# EAGLE design HUM-ASM-001 (EAGLE 9.5.1)

## Sheet 1 of 3: MCU
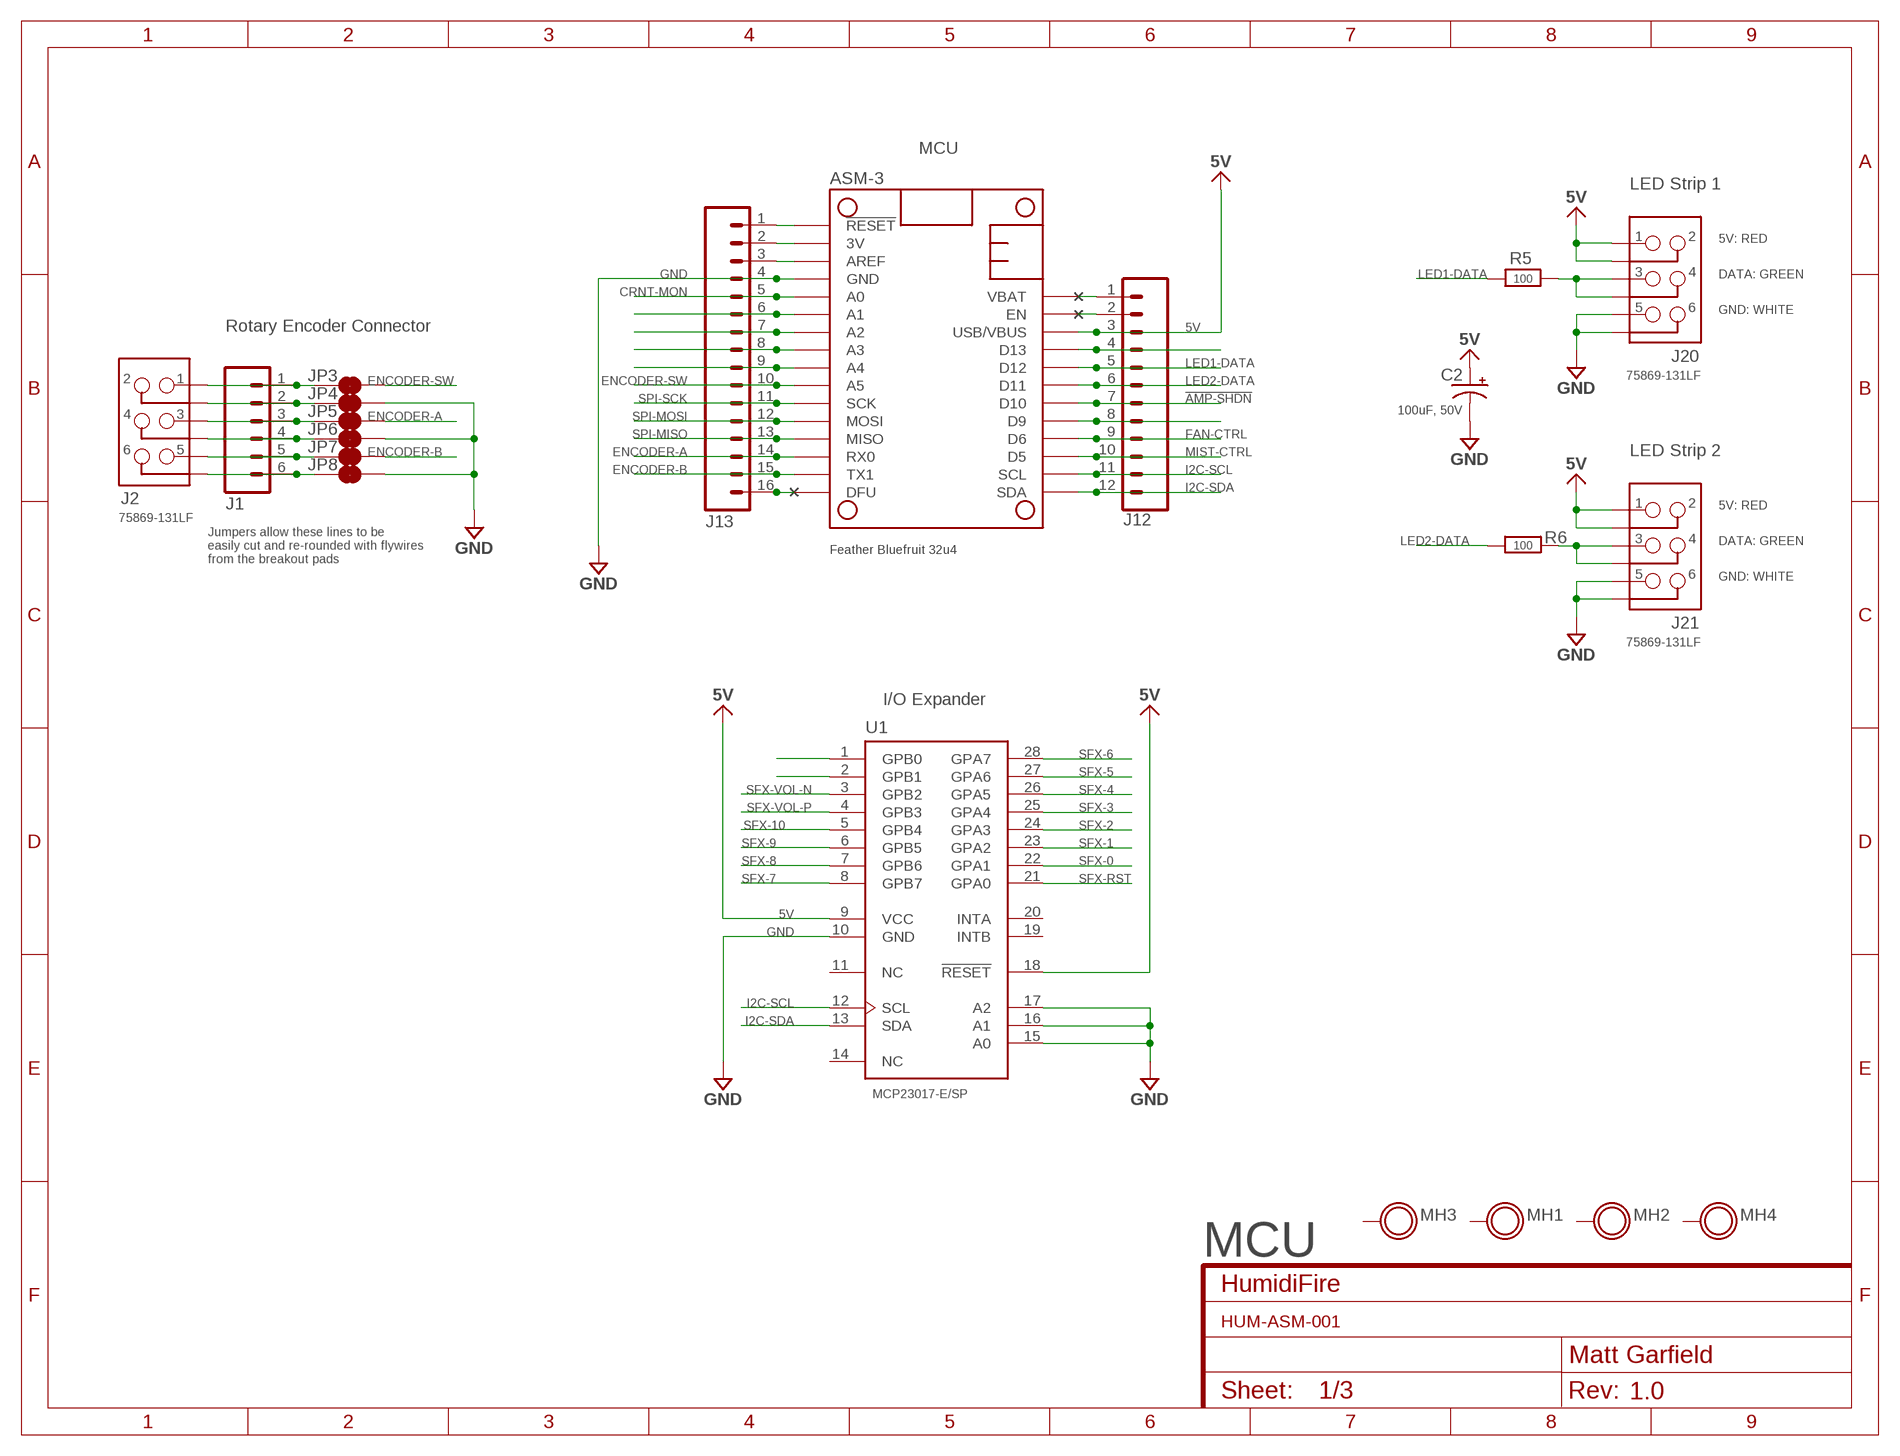
[diagram p0: schematic, sheet 1]
FRAME1 (SCH_FRAME_LETTER_8.5X11): CNAME: HumidiFire; CREVISION: 1.0; DESIGNER: Matt Garfield

### Parts
ASM-3  Feather Bluefruit 32u4  ASM_ADAFRUIT_FEATHER_BLUEFRUIT  [ASM_ADAFRUIT_FEATHER_BLUEFRUIT]
C2  100uF, 50V  CAP_THT_POL-E-035X080MM  [CAP_E-035X080]
J1  CON_HEADER_1X6NO_SILK_FEMALE_PTH  [1X06_NO_SILK]
J2  75869-131LF  CON_HEADER_2X3-SHROUD  [2X3-SHROUDED]
J12  CON_HEADER_1X12_NO_SILK  [1X12_NO_SILK]
J13  CON_HEADER_1X16-1X16_NO_SILK  [1X16_NO_SILK]
J20  75869-131LF  CON_HEADER_2X3-SHROUD  [2X3-SHROUDED]
J21  75869-131LF  CON_HEADER_2X3-SHROUD  [2X3-SHROUDED]
JP3  CON_JUMPER_PAD-2-NC_BY_TRACE  [PAD-JUMPER-2-NC_BY_TRACE_YES_SILK]
JP4  CON_JUMPER_PAD-2-NC_BY_TRACE  [PAD-JUMPER-2-NC_BY_TRACE_YES_SILK]
JP5  CON_JUMPER_PAD-2-NC_BY_TRACE  [PAD-JUMPER-2-NC_BY_TRACE_YES_SILK]
JP6  CON_JUMPER_PAD-2-NC_BY_TRACE  [PAD-JUMPER-2-NC_BY_TRACE_YES_SILK]
JP7  CON_JUMPER_PAD-2-NC_BY_TRACE  [PAD-JUMPER-2-NC_BY_TRACE_YES_SILK]
JP8  CON_JUMPER_PAD-2-NC_BY_TRACE  [PAD-JUMPER-2-NC_BY_TRACE_YES_SILK]
MH1  PCB_MOUNTING-HOLE_IN_PLATED  [TOOLING_HOLE_0.125_IN_HORSESHOE]
MH2  PCB_MOUNTING-HOLE_IN_PLATED  [TOOLING_HOLE_0.125_IN_HORSESHOE]
MH3  PCB_MOUNTING-HOLE_IN_PLATED  [TOOLING_HOLE_0.125_IN_HORSESHOE]
MH4  PCB_MOUNTING-HOLE_IN_PLATED  [TOOLING_HOLE_0.125_IN_HORSESHOE]
R5  100  RES_RESISTOR-PTH-1/4W  [AXIAL-0.4]
R6  100  RES_RESISTOR-PTH-1/4W  [AXIAL-0.4]
U1  MCP23017-E/SP  IIC_MCP23017-E/SP  [DIP787W45P254L3556H508Q28]

### Nets
3V: ASM-3.3V3(3V) J13.2
5V: ASM-3.USB/VBUS C2.+ J12.3 J20.1 J20.2 J21.1 J21.2 U1.9(VCC) U1.18(!RESET) ; supply symbol labelled V5.0 ; also sheet 2,3
!AMP-SHDN: ASM-3.D10 J12.7 ; also sheet 3
CRNT-MON: ASM-3.A0 J13.5 ; also sheet 2
DFU: ASM-3.DFU J13.16
ENCODER-A: ASM-3.RX0 J13.14 JP5.1
ENCODER-B: ASM-3.TX1 J13.15 JP7.1
ENCODER-SW: ASM-3.A5 J13.10 JP3.1
FAN-CTRL: ASM-3.D6 J12.9 ; also sheet 2
GND: ASM-3.GND@4(GND) C2.- J13.4 J20.5 J20.6 J21.5 J21.6 JP4.1 JP6.1 JP8.1 U1.10(GND) U1.15(A0) U1.16(A1) U1.17(A2) ; supply symbol labelled V0_GND ; also sheet 2,3
I2C-SCL: ASM-3.SCL J12.11 U1.12(SCL)
I2C-SDA: ASM-3.SDA J12.12 U1.13(SDA)
LED1-DATA: ASM-3.D12 J12.5 R5.P$2(P2)
LED2-DATA: ASM-3.D11 J12.6 R6.P$1(P1)
MIST-CTRL: ASM-3.D5 J12.10 ; also sheet 2
N$1: ASM-3.!RESET J13.1
N$2: ASM-3.AREF J13.3
N$3: U1.1(GPB0)
N$4: U1.2(GPB1)
N$5: ASM-3.A1 J13.6
N$6: ASM-3.A2 J13.7
N$7: ASM-3.A3 J13.8
N$8: ASM-3.A4 J13.9
N$9: J20.3 J20.4 R5.P$1(P1)
N$18: J1.1 J2.1 JP3.2
N$20: ASM-3.D9 J12.8
N$21: J1.2 J2.2 JP4.2
N$22: J1.3 J2.3 JP5.2
N$24: ASM-3.D13 J12.4
N$25: ASM-3.EN J12.2
N$39: J1.4 J2.4 JP6.2
N$40: J1.5 J2.5 JP7.2
N$41: J1.6 J2.6 JP8.2
N$42: J21.3 J21.4 R6.P$2(P2)
SFX-0: U1.22(GPA1) ; also sheet 3
SFX-1: U1.23(GPA2) ; also sheet 3
SFX-2: U1.24(GPA3) ; also sheet 3
SFX-3: U1.25(GPA4) ; also sheet 3
SFX-4: U1.26(GPA5) ; also sheet 3
SFX-5: U1.27(GPA6) ; also sheet 3
SFX-6: U1.28(GPA7) ; also sheet 3
SFX-7: U1.8(GPB7) ; also sheet 3
SFX-8: U1.7(GPB6) ; also sheet 3
SFX-9: U1.6(GPB5) ; also sheet 3
SFX-10: U1.5(GPB4) ; also sheet 3
SFX-RST: U1.21(GPA0) ; also sheet 3
SFX-VOL-N: U1.3(GPB2) ; also sheet 3
SFX-VOL-P: U1.4(GPB3) ; also sheet 3
SPI-MISO: ASM-3.MISO J13.13
SPI-MOSI: ASM-3.MOSI J13.12
SPI-SCK: ASM-3.SCK J13.11
VBAT: ASM-3.VBAT J12.1
Unconnected: MH1.P$1(P1) MH2.P$1(P1) MH3.P$1(P1) MH4.P$1(P1) U1.11(NC) U1.14(NC) U1.19(INTB) U1.20(INTA)

### Notes on the sheet
- MCU
- LED Strip 1
- 5V: RED
- DATA: GREEN
- GND: WHITE
- Rotary Encoder Connector
- LED Strip 2
- 5V: RED
- DATA: GREEN
- Jumpers allow these lines to be
  easily cut and re-rounded with flywires 
  from the breakout pads
- GND: WHITE
- I/O Expander
- MCU

## Sheet 2 of 3: Power
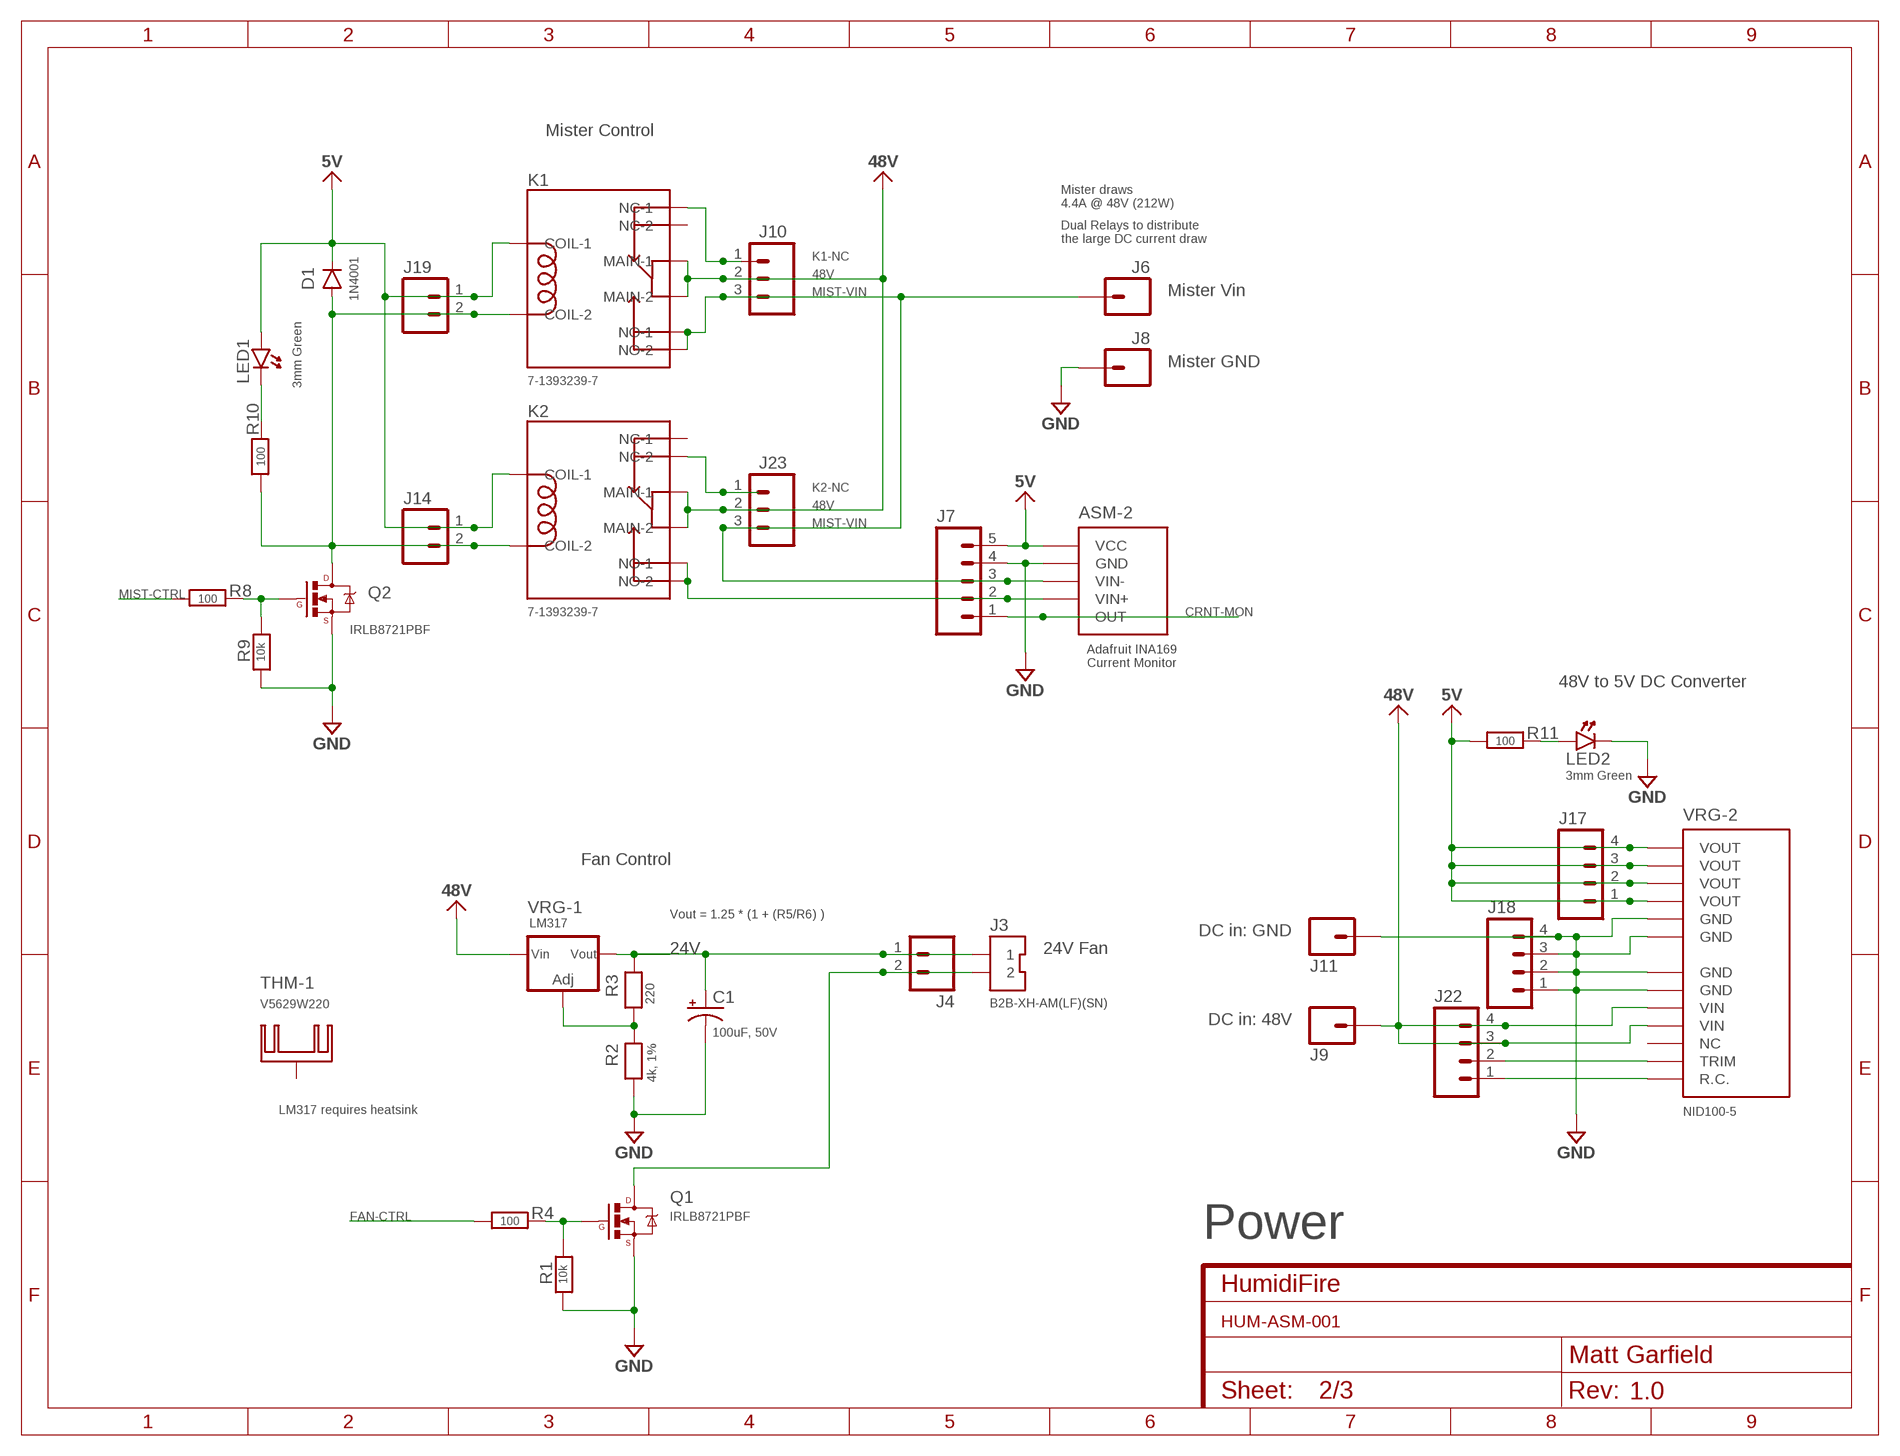
[diagram p1: schematic, sheet 2]
FRAME4 (SCH_FRAME_LETTER_8.5X11): CNAME: HumidiFire; CREVISION: 1.0; DESIGNER: Matt Garfield

### Parts
ASM-2  ASM_ADAFRUIT_INA169  [ASM_ADAFRUIT_INA169_MOUNTING_HOLES]
C1  100uF, 50V  CAP_THT_POL-E-035X080MM  [CAP_E-035X080]
D1  1N4001  DIO_DIODEPTH  [DIODE-1N4001]
J3  B2B-XH-AM(LF)(SN)  CON_JST_2-PIN_B2B-XH-AM  [JST-2-PTH-VERT_XH]
J4  CON_HEADER_1X21X02_NO_SILK  [1X02_NO_SILK]
J6  CON_HEADER_1X1-QC_TAB_121786-1  [TE_1217861-1]
J7  CON_HEADER_1X5NO_SILK  [1X05_NO_SILK]
J8  CON_HEADER_1X1-QC_TAB_121786-1  [TE_1217861-1]
J9  CON_HEADER_1X1-QC_TAB_121786-1  [TE_1217861-1]
J10  CON_HEADER_1X3PTH  [1X03]
J11  CON_HEADER_1X1-QC_TAB_121786-1  [TE_1217861-1]
J14  CON_HEADER_1X21X02_NO_SILK  [1X02_NO_SILK]
J17  CON_HEADER_1X4PTH  [1X04]
J18  CON_HEADER_1X4PTH  [1X04]
J19  CON_HEADER_1X21X02_NO_SILK  [1X02_NO_SILK]
J22  CON_HEADER_1X4NO_SILK_ALL_ROUND  [1X04_NO_SILK_ALL_ROUND]
J23  CON_HEADER_1X3PTH  [1X03]
K1  7-1393239-7  EMD_RELAY_SPDT_8-PIN_TE_7-1393239-7  [RELAY_TE_7-1393239-7]
K2  7-1393239-7  EMD_RELAY_SPDT_8-PIN_TE_7-1393239-7  [RELAY_TE_7-1393239-7]
LED1  3mm Green  LED_THT-3MM  [LED3MM]
LED2  3mm Green  LED_THT-3MM  [LED3MM]
Q1  IRLB8721PBF  TRN_MOSFET-N_TO-220_VERTICAL  [TO-220-VERTICAL]
Q2  IRLB8721PBF  TRN_MOSFET-N_TO-220_VERTICAL  [TO-220-VERTICAL]
R1  10k  RES_RESISTOR-PTH-1/4W  [AXIAL-0.4]
R2  4k, 1%  RES_RESISTOR-PTH-1/4W  [AXIAL-0.4]
R3  220  RES_RESISTOR-PTH-1/4W  [AXIAL-0.4]
R4  100  RES_RESISTOR-PTH-1/4W  [AXIAL-0.4]
R8  100  RES_RESISTOR-PTH-1/4W  [AXIAL-0.4]
R9  10k  RES_RESISTOR-PTH-1/4W  [AXIAL-0.4]
R10  100  RES_RESISTOR-PTH-1/4W  [AXIAL-0.4]
R11  100  RES_RESISTOR-PTH-1/4W  [AXIAL-0.4]
THM-1  V5629W220  THM_HEATSINK_1-PIN  [SK95-2M3]
VRG-1  LM317  VRG_LM317_TO-220_VERTICAL  [TO-220-VERTICAL]
VRG-2  NID100-5  VRG_NID100  [VRG_NID100-X]

### Nets
5V: ASM-2.1(VCC) D1.C J7.5 J14.1 J17.1 J17.2 J17.3 J17.4 J19.1 K1.COIL-1 K2.COIL-1 LED1.A R11.P$1(P1) VRG-2.P$1(VOUT) VRG-2.P$2(VOUT) VRG-2.P$3(VOUT) VRG-2.P$4(VOUT) ; supply symbol labelled V5.0 ; also sheet 1,3
24V: C1.+ J3.1 J4.1 R3.P$2(P2) VRG-1.P2(VOUT)
48V: J9.1 J9.2 J10.2 J22.3 J22.4 J23.2 K1.MAIN-1 K1.MAIN-2 K2.MAIN-1 K2.MAIN-2 VRG-1.P3(VIN) VRG-2.P$9(VIN) VRG-2.P$10(VIN) ; supply symbol labelled V48
ADJ: R2.P$2(P2) R3.P$1(P1) VRG-1.P1(ADJ)
CRNT-MON: ASM-2.5(OUT) J7.1 ; also sheet 1
FAN-CTRL: R4.P$1(P1) ; also sheet 1
GND: ASM-2.2(GND) C1.- J7.4 J8.1 J8.2 J11.1 J11.2 J18.1 J18.2 J18.3 J18.4 LED2.K(C) Q1.P3(S) Q2.P3(S) R1.P$2(P2) R2.P$1(P1) R9.P$2(P2) VRG-2.P$5(GND) VRG-2.P$6(GND) VRG-2.P$7(GND) VRG-2.P$8(GND) ; supply symbol labelled V0_GND ; also sheet 1,3
K1-NC: J10.1 K1.NC-1
K2-NC: J23.1 K2.NC-2
MIST-CTRL: R8.P$1(P1) ; also sheet 1
MIST-VIN: ASM-2.3(VIN-) J6.1 J6.2 J7.3 J10.3 J23.3 K1.NO-1 K1.NO-2
N$10: D1.A J14.2 J19.2 K1.COIL-2 K2.COIL-2 Q2.P2(D) R10.P$1(P1)
N$11: Q2.P1(G) R8.P$2(P2) R9.P$1(P1)
N$12: J3.2 J4.2 Q1.P2(D)
N$13: LED1.K(C) R10.P$2(P2)
N$16: ASM-2.4(VIN+) J7.2 K2.NO-1 K2.NO-2
N$17: Q1.P1(G) R1.P$1(P1) R4.P$2(P2)
N$19: LED2.A R11.P$2(P2)
N$27: J22.1 VRG-2.P$13(R.C.)
N$29: J22.2 VRG-2.P$12(TRIM)
Unconnected: K1.NC-2 K2.NC-1 THM-1.P$1(K) VRG-2.P$11(NC)

### Notes on the sheet
- Mister Control
- Mister draws 
  4.4A @ 48V (212W)
- Dual Relays to distribute
  the large DC current draw
- Mister Vin
- Mister GND
- 48V to 5V DC Converter
- Fan Control
- Vout = 1.25 * (1 + (R5/R6) )
- DC in: GND
- 24V Fan
- DC in: 48V
- LM317 requires heatsink
- Power

## Sheet 3 of 3: Audio
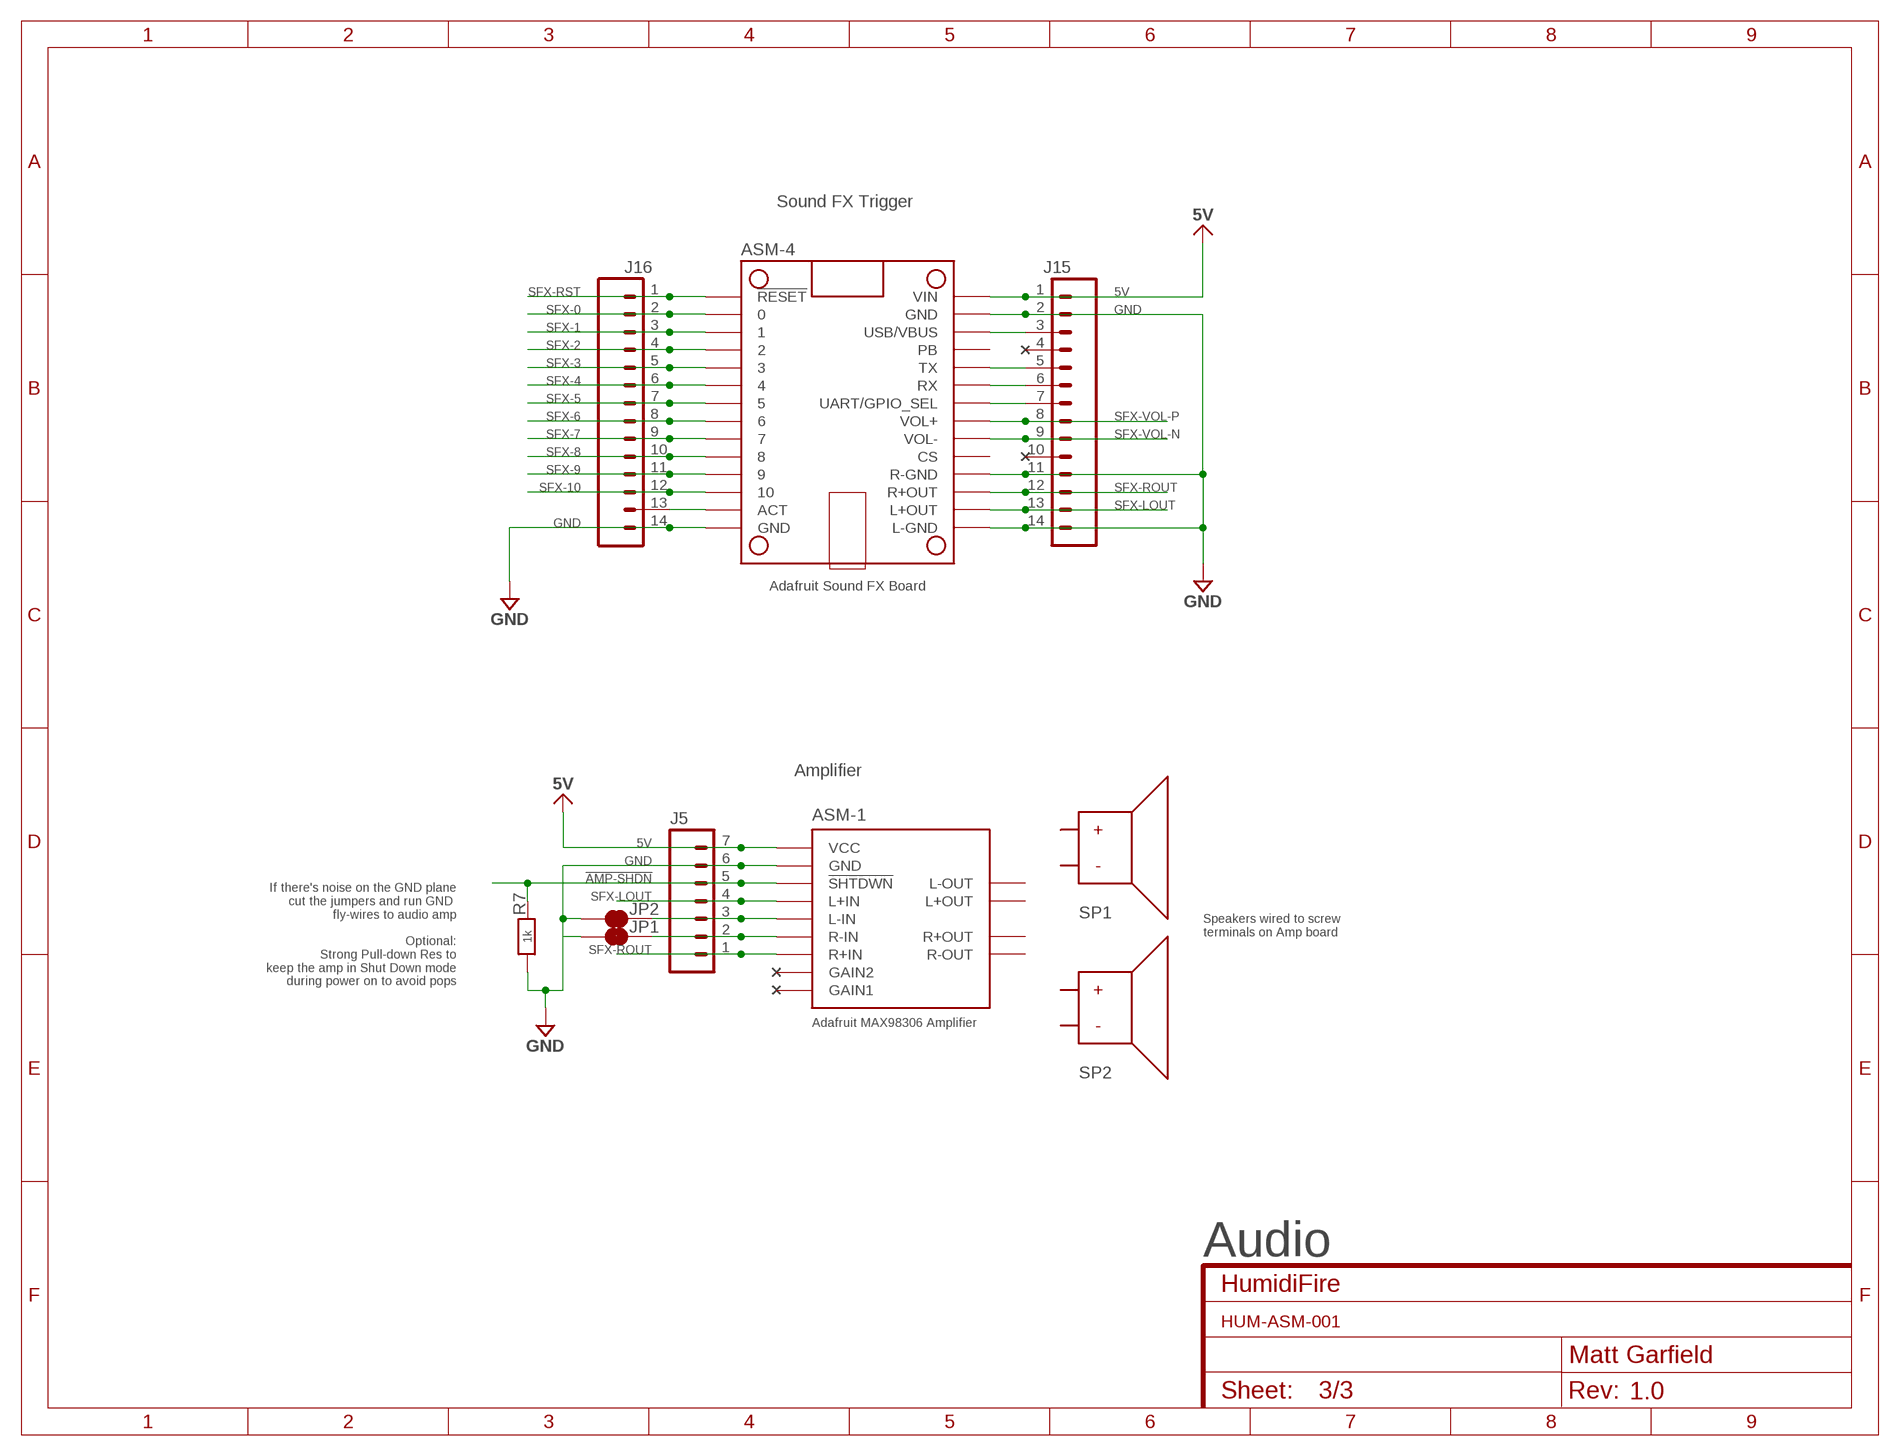
[diagram p2: schematic, sheet 3]
FRAME2 (SCH_FRAME_LETTER_8.5X11): CNAME: HumidiFire; CREVISION: 1.0; DESIGNER: Matt Garfield

### Parts
ASM-1  ASM_ADAFRUIT_MAX98306_AMP  [ASM_ADAFRUIT_MAX98306_AMP_MOUNTING_HOLES]
ASM-4  ASM_ADAFRUIT_SOUND_FX_BOARD  [ASM_ADAFRUIT_SOUND_FX_BOARD]
J5  CON_HEADER_1X7NO_SILK  [1X07_NO_SILK]
J15  CON_HEADER_1X14  [1X14_NO_SILK]
J16  CON_HEADER_1X14  [1X14_NO_SILK]
JP1  CON_JUMPER_PAD-2-NC_BY_TRACE  [PAD-JUMPER-2-NC_BY_TRACE_YES_SILK]
JP2  CON_JUMPER_PAD-2-NC_BY_TRACE  [PAD-JUMPER-2-NC_BY_TRACE_YES_SILK]
R7  1k  RES_RESISTOR-PTH-1/4W  [AXIAL-0.4]

### Nets
5V: ASM-1.1(VCC) ASM-4.28(VIN) J5.7 J15.1 ; supply symbol labelled V5.0 ; also sheet 1,2
!AMP-SHDN: ASM-1.3(!SHTDWN) J5.5 R7.P$2(P2) ; also sheet 1
GND: ASM-1.2(GND) ASM-4.14(GND) ASM-4.15(L-GND) ASM-4.18(R-GND) ASM-4.27(GND) J5.6 J15.2 J15.11 J15.14 J16.14 JP1.1 JP2.1 R7.P$1(P1) ; supply symbol labelled V0_GND ; also sheet 1,2
N$14: ASM-1.5(L-IN) J5.3 JP2.2
N$15: ASM-1.6(R-IN) J5.2 JP1.2
N$26: ASM-4.13(ACT) J16.13
N$30: ASM-4.24(TX) J15.5
N$31: ASM-4.23(RX) J15.6
N$38: ASM-4.22(UART/GPIO_SEL) J15.7
SFX-0: ASM-4.2 J16.2 ; also sheet 1
SFX-1: ASM-4.3 J16.3 ; also sheet 1
SFX-2: ASM-4.4 J16.4 ; also sheet 1
SFX-3: ASM-4.5 J16.5 ; also sheet 1
SFX-4: ASM-4.6 J16.6 ; also sheet 1
SFX-5: ASM-4.7 J16.7 ; also sheet 1
SFX-6: ASM-4.8 J16.8 ; also sheet 1
SFX-7: ASM-4.9 J16.9 ; also sheet 1
SFX-8: ASM-4.10 J16.10 ; also sheet 1
SFX-9: ASM-4.11 J16.11 ; also sheet 1
SFX-10: ASM-4.12 J16.12 ; also sheet 1
SFX-LOUT: ASM-1.4(L+IN) ASM-4.16(L+OUT) J5.4 J15.13
SFX-ROUT: ASM-1.7(R+IN) ASM-4.17(R+OUT) J5.1 J15.12
SFX-RST: ASM-4.1(!RESET) J16.1 ; also sheet 1
SFX-VOL-N: ASM-4.20(VOL-) J15.9 ; also sheet 1
SFX-VOL-P: ASM-4.21(VOL+) J15.8 ; also sheet 1
USB/VBUS: ASM-4.26(USB/VBUS) J15.3
Unconnected: ASM-1.8(GAIN2) ASM-1.9(GAIN1) ASM-1.12(L-OUT) ASM-1.13(L+OUT) ASM-1.14(R+OUT) ASM-1.15(R-OUT) ASM-4.19(CS) ASM-4.25(PB) J15.4 J15.10

### Notes on the sheet
- Sound FX Trigger
- Amplifier
- If there's noise on the GND plane
  cut the jumpers and run GND 
  fly-wires to audio amp
- Optional:
  Strong Pull-down Res to
  keep the amp in Shut Down mode
  during power on to avoid pops
- Speakers wired to screw 
  terminals on Amp board
- Audio

## Library data of the parts
ASM-1 = MG-Eagle_v1:ASM_ADAFRUIT_MAX98306_AMP
ASM-2 = MG-Eagle_v1:ASM_ADAFRUIT_INA169
ASM-3 = MG-Eagle_v1:ASM_ADAFRUIT_FEATHER_BLUEFRUIT
ASM-4 = MG-Eagle_v1:ASM_ADAFRUIT_SOUND_FX_BOARD
C1 C2 = MG-Eagle_v1:CAP_THT_POL: Capacitor Standard 0603 ceramic capacitor, and 0.1" leaded capacitor.
D1 = MG-Eagle_v1:DIO_DIODE: Diode These are standard reverse protection diodes and small signal diodes. SMA package can handle up to about 1A. SOD-323 can handle about 200mA. What the SOD-323 package when ordering, there are some mfgs out there that are 5-pin packages.
J1 = MG-Eagle_v1:CON_HEADER_1X6: Header 6 Standard 6-pin 0.1" header. Use with straight break away headers (SKU : PRT-00116), right angle break away headers (PRT-00553), swiss pins (PRT-00743), machine pins (PRT-00117), and female headers (PRT-00115). Molex polarized connector foot print use with SKU : PRT-08094 with associated crimp pins and housings. NOTES ON THE VARIANTS LOCK and LOCK_LONGPADS... This footprint was designed to help hold the alignment of a through-hole component (i.e. 6-pin header) while soldering it into place. You may notice that each hole has been shifted either up or down by 0.005 of an inch from it's more standard position (which is a perfectly straight line). This slight alteration caused the pins (the squares in the middle) to touch the edges of the holes. Because they are alternating, it causes a "brace" to hold the component in place. 0.005 has proven to be the perfect amount of "off-center" position when using our standard breakaway headers. Although looks a little odd when you look at the bare footprint, once you have a header in there, the alteration is very hard to notice. Also,if you push a header all the way into place, it is covered up entirely on the bottom side. This idea of altering the position of holes to aid alignment will be further integrated into the Sparkfun Library for other footprints. It can help hold any component with 3 or more connection pins.; PROD_ID: CONN-08437
J2 J20 J21 = MG-Eagle_v1:CON_HEADER_2X3: 2x3 .1" header.; PROD_ID: CONN-10681
J3 = MG-Eagle_v1:CON_JST_2-PIN
J4 J14 J19 = MG-Eagle_v1:CON_HEADER_1X2: Standard 2-pin 0.1" header. Use with - straight break away headers ( PRT-00116) - right angle break away headers (PRT-00553) - swiss pins (PRT-00743) - machine pins (PRT-00117) - female headers (PRT-00115) Molex polarized connector foot print use with: PRT-08233 with associated crimp pins and housings. 2.54_SCREWTERM for use with PRT-10571. 3.5mm Screw Terminal footprints for PRT-08084 5mm Screw Terminal footprints for use with PRT-08432
J5 = MG-Eagle_v1:CON_HEADER_1X7: Header 7 Standard 7-pin 0.1" header. Use with straight break away headers (SKU : PRT-00116), right angle break away headers (PRT-00553), swiss pins (PRT-00743), machine pins (PRT-00117), and female headers (PRT-00115). NOTES ON THE VARIANTS LOCK and LOCK_LONGPADS... This footprint was designed to help hold the alignment of a through-hole component (i.e. 7-pin header) while soldering it into place. You may notice that each hole has been shifted either up or down by 0.005 of an inch from it's more standard position (which is usually a perfectly straight line). This slight alteration caused the pins (the squares in the middle) to touch the edges of the holes. Because they are alternating, it causes a "brace" to hold the header in place. 0.005 has proven to be the perfect amount of "off-center" position when using our standard breakaway headers. Although looks a little odd when you look at the bare footprint, once you have a header in there, the alteration is very hard to notice. Also, if you push a header all the way into place, it is covered up entirely on the bottom side. This idea of altering the position of holes to aid alignment will be further integrated into the Sparkfun Library for other footprints. It can help hold any component with 3 or more connection pins.
J6 J8 J9 J11 = MG-Eagle_v1:CON_HEADER_1X1: Header 1 Standard 1-pin 0.1" header. Use with straight break away headers (SKU : PRT-00116), right angle break away headers (PRT-00553), swiss pins (PRT-00743), machine pins (PRT-00117), and female headers (PRT-00115). SMTSO-256-ET is a "flush mount" nut for a 4-40 screw. The older package used to be too tight, and did not allow it to sit properly thru the drill hit. The latest (0.165DIA) fits nice and snug.
J7 = MG-Eagle_v1:CON_HEADER_1X5: Header 5 Standard 5-pin 0.1" header. Use with straight break away headers (SKU : PRT-00116), right angle break away headers (PRT-00553), swiss pins (PRT-00743), machine pins (PRT-00117), and female headers (PRT-00115). Molex polarized connector foot print use with SKU : PRT-08230 with associated crimp pins and housings.
J10 J23 = MG-Eagle_v1:CON_HEADER_1X3: Header 3 Standard 3-pin 0.1" header. Use with straight break away headers (SKU : PRT-00116), right angle break away headers (PRT-00553), swiss pins (PRT-00743), machine pins (PRT-00117), and female headers (PRT-00115). Molex polarized connector foot print use with SKU : PRT-08232 with associated crimp pins and housings.
J12 = MG-Eagle_v1:CON_HEADER_1X12
J13 = MG-Eagle_v1:CON_HEADER_1X16: 1x16 .1" header
J15 J16 = MG-Eagle_v1:CON_HEADER_1X14
J17 J18 J22 = MG-Eagle_v1:CON_HEADER_1X4: Header 4 Standard 4-pin 0.1" header. Use with straight break away headers (SKU : PRT-00116), right angle break away headers (PRT-00553), swiss pins (PRT-00743), machine pins (PRT-00117), and female headers (PRT-00115). Molex polarized connector foot print use with SKU : PRT-08231 with associated crimp pins and housings. 1MM SMD Version SKU: PRT-10208; PROD_ID: CONN-09696
JP1-JP8 = MG-Eagle_v1:CON_JUMPER_PAD-2-NC_BY_TRACE
K1 K2 = MG-Eagle_v1:EMD_RELAY_SPDT_8-PIN
LED1 LED2 = MG-Eagle_v1:LED_THT: LEDs Standard schematic elements and footprints for 5mm, 3mm, 1206, and 0603 sized LEDs. 5mm - Spark Fun Electronics SKU : COM-00529 (and others); PROD_ID: DIO-08794
MH1-MH4 = MG-Eagle_v1:PCB_MOUNTING-HOLE_IN_PLATED
Q1 Q2 = MG-Eagle_v1:TRN_MOSFET-N: Common NMOSFET Parts MFG P/N Store ID Prod ID FDD8780 TRANS-09984 SI7820DN TRANS-11055 FDS6630A IC-08089 2N7002PW TRANS-11151 FQP30N06L COM-10213 TRANS-10060 BSS123LT1G TRANS-08345 BSS138 TRANS-00830 BS170 2N7000; PROD_ID: TRANS-10060
R1-R11 = MG-Eagle_v1:RES_RESISTOR: Resistor Basic schematic elements and footprints for 0603, 1206, and PTH resistors.
THM-1 = MG-Eagle_v1:THM_HEATSINK_1-PIN: HEATSINK manufacturer Fischer/distributor Buerklin
U1 = MG-Eagle_v1:IIC_MCP23017-E/SP: MCP23017 Series 5.5 V 1.7 MHz SMT 16-Bit I2C I/O Expander - SPDIP-28; DESCRIPTION: MCP23017 Series 5.5 V 1.7 MHz SMT 16-Bit I2C I/O Expander - SPDIP-28; DIGI-KEY_PART_NUMBER: MCP23017-E/SP-ND; DIGI-KEY_PURCHASE_URL: https://www.digikey.com/product-detail/en/microchip-technology/MCP23017-E-SP/MCP23017-E-SP-ND/894272?utm_source=snapeda&utm_medium=aggregator&utm_campaign=symbol; MF: Microchip; MP: MCP23017-E/SP; PACKAGE: DIP-28 Microchip
VRG-1 = MG-Eagle_v1:VRG_LM317
VRG-2 = MG-Eagle_v1:VRG_NID100

## Board
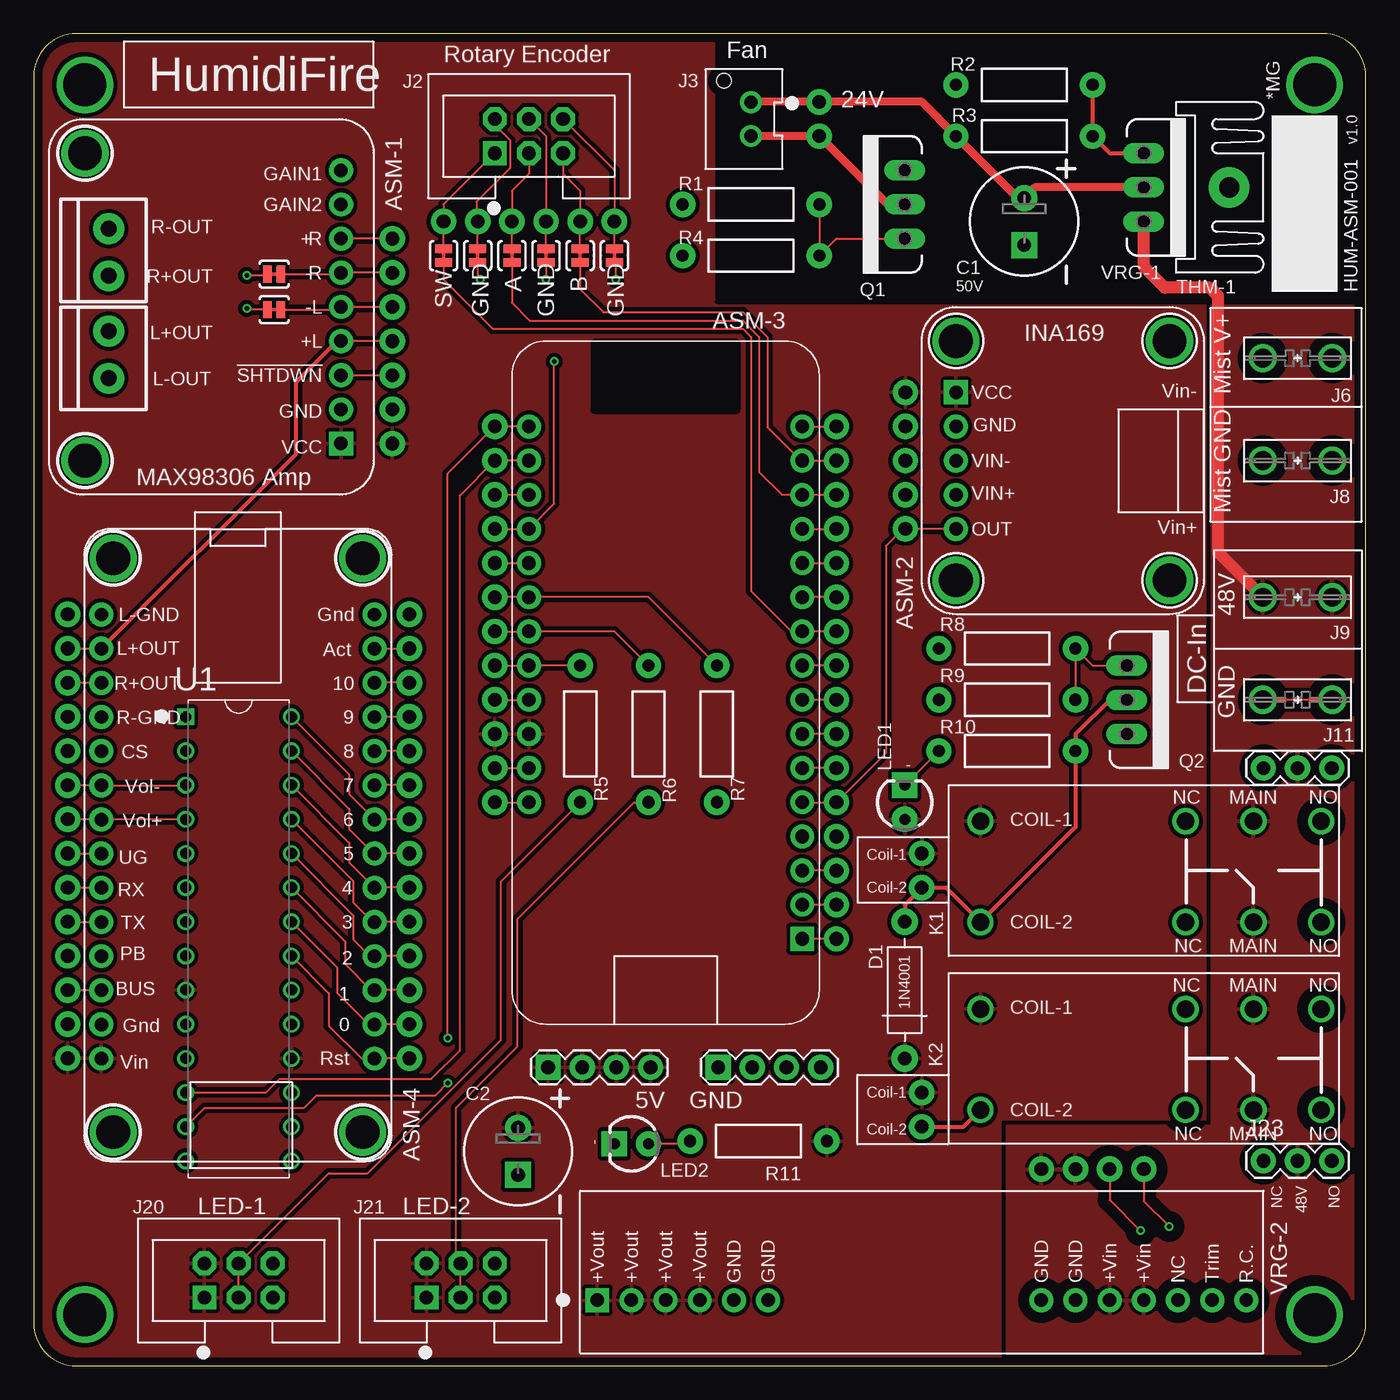
[diagram p3: board, top side]
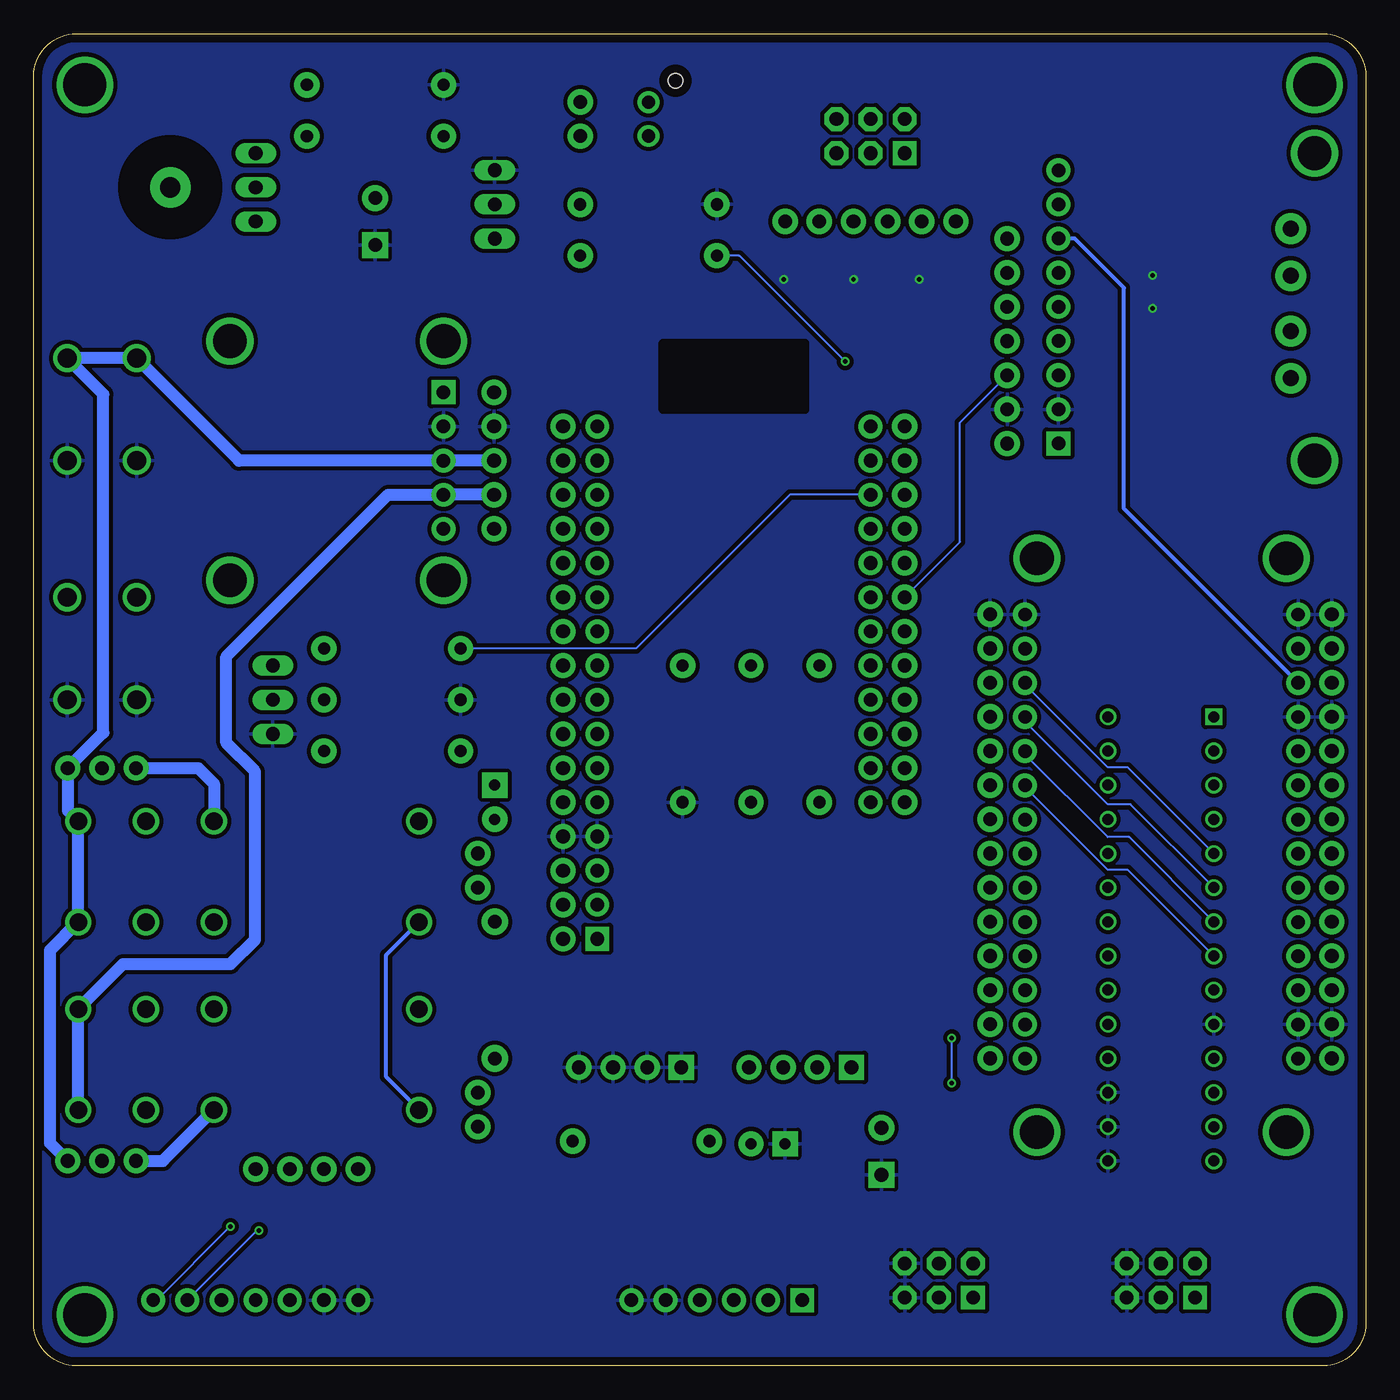
[diagram p4: board, bottom side, seen from below]

Size 99.06 x 99.06 mm. Coordinates in mm from the lower left corner, seen from the top.
Outline: 0,95.89 0,3.17 arc90 3.17,0 95.89,0 arc90 99.06,3.17 99.06,95.89 arc90 95.89,99.06 3.17,99.06 arc90 0,95.89
Copper layers (1*16): Top 0.035mm / dielectric 1.5mm / Bottom 0.035mm
Design rules "SeeedStudio_2layer_DRU_2017-06-08_MG": minimum track width 6mil, minimum drill 12mil, track to track 6mil, track to pad 6mil, pad to pad 6mil, via to via 6mil, smd to smd 0mil, copper to edge 25mil, drill to drill 10mil, minimum pad ring 6mil, minimum via ring 6mil, stop-mask expansion 2mil, vias tented up to drill 15mil, thermal gap 10mil

### Footprints (pad centres in the part's own frame; a part is rotated, then mirrored left to right if it is on the bottom)
ASM_ADAFRUIT_MAX98306_AMP_MOUNTING_HOLES = drill 1 pad 1.778 square: 1 -8.89,10.16 | drill 1 pad 1.778: 2 -8.89,7.62; 3 -8.89,5.08; 4 -8.89,2.54; 5 -8.89,0; 6 -8.89,-2.54; 7 -8.89,-5.08; 8 -8.89,-7.62; 9 -8.89,-10.16 | drill 2.5 pad 3.2: 10 10.16,11.43; 11 10.16,-11.43 | drill 1.194 pad 2.286: 12 8.382,5.309; 13 8.382,1.803; 14 8.382,-2.311; 15 8.382,-5.817
ASM_ADAFRUIT_INA169_MOUNTING_HOLES = drill 1 pad 1.778 square: 1 -5.08,-8.89 | drill 1 pad 1.778: 2 -2.54,-8.89; 3 0,-8.89; 4 2.54,-8.89; 5 5.08,-8.89 | drill 2.5 pad 3.2: P$1 -8.89,-8.89; P$2 -8.89,7; P$3 8.89,7; P$4 8.89,-8.89
ASM_ADAFRUIT_FEATHER_BLUEFRUIT = drill 1.016 pad 1.778: 3V3 -10.16,17.78; A0 -10.16,10.16; A1 -10.16,7.62; A2 -10.16,5.08; A3 -10.16,2.54; A4 -10.16,0; A5 -10.16,-2.54; AREF -10.16,15.24; D5 10.16,-12.7; D6 10.16,-10.16; D9 10.16,-7.62; D10 10.16,-5.08; D11 10.16,-2.54; D12 10.16,0; D13 10.16,2.54; DFU -10.16,-17.78; EN 10.16,7.62; GND@4 -10.16,12.7; MISO -10.16,-10.16; MOSI -10.16,-7.62; RX0 -10.16,-12.7; SCK -10.16,-5.08; SCL 10.16,-15.24; SDA 10.16,-17.78; TX1 -10.16,-15.24; USB/VBUS 10.16,5.08; VBAT 10.16,10.16 | drill 1.016 pad 1.778 square: !RESET -10.16,20.32
ASM_ADAFRUIT_SOUND_FX_BOARD = drill 1 pad 1.778: 1 -15.38,-9.73; 2 -12.84,-9.73; 3 -10.3,-9.73; 4 -7.76,-9.73; 5 -5.22,-9.73; 6 -2.68,-9.73; 7 -0.14,-9.73; 8 2.4,-9.73; 9 4.94,-9.73; 10 7.48,-9.73; 11 10.02,-9.73; 12 12.56,-9.73; 13 15.1,-9.73; 14 17.64,-9.73; 15 17.64,10.59; 16 15.1,10.59; 17 12.56,10.59; 18 10.02,10.59; 19 7.48,10.59; 20 4.94,10.59; 21 2.4,10.59; 22 -0.14,10.59; 23 -2.68,10.59; 24 -5.22,10.59; 25 -7.76,10.59; 26 -10.3,10.59; 27 -12.84,10.59; 28 -15.38,10.59 | drill 2.5 pad 3.2: 29 -20.841,-8.841; 30 -20.841,9.701; 31 21.831,9.701; 32 21.831,-8.841
CAP_E-035X080 = drill 1.016 pad 1.93: + -1.75,0 | drill 1.016 pad 1.93 square: - 1.75,0
DIODE-1N4001 = drill 1 pad 1.981: A -5.08,0; C 5.08,0
1X06_NO_SILK = drill 1.016 pad 1.88: 1 0,0; 2 2.54,0; 3 5.08,0; 4 7.62,0; 5 10.16,0; 6 12.7,0
2X3-SHROUDED = drill 1.016 pad 1.778 square: 1 -2.54,-1.27 | drill 1.016 pad 1.778 octagon: 2 -2.54,1.27; 3 0,-1.27; 4 0,1.27; 5 2.54,-1.27; 6 2.54,1.27
JST-2-PTH-VERT_XH = drill 1 pad 1.6: 1 -1.25,0; 2 1.25,0 | hole 1.1: -2.85,-2
1X02_NO_SILK = drill 1.016 pad 1.88: 1 0,0; 2 2.54,0
1X07_NO_SILK = drill 1.016 pad 1.88: 1 0,0; 2 2.54,0; 3 5.08,0; 4 7.62,0; 5 10.16,0; 6 12.7,0; 7 15.24,0
TE_1217861-1 = drill 1.4: 1 -2.578,0; 2 2.578,0
1X05_NO_SILK = drill 1.016 pad 1.88: 1 0,0; 2 2.54,0; 3 5.08,0; 4 7.62,0; 5 10.16,0
1X03 = drill 1.016 pad 1.88: 1 0,0; 2 2.54,0; 3 5.08,0
1X12_NO_SILK = drill 1.016 pad 1.88: 1 0,0; 2 2.54,0; 3 5.08,0; 4 7.62,0; 5 10.16,0; 6 12.7,0; 7 15.24,0; 8 17.78,0; 9 20.32,0; 10 22.86,0; 11 25.4,0; 12 27.94,0
1X16_NO_SILK = drill 1.016 pad 1.88: 1 0,0; 2 2.54,0; 3 5.08,0; 4 7.62,0; 5 10.16,0; 6 12.7,0; 7 15.24,0; 8 17.78,0; 9 20.32,0; 10 22.86,0; 11 25.4,0; 12 27.94,0; 13 30.48,0; 14 33.02,0; 15 35.56,0; 16 38.1,0
1X14_NO_SILK = drill 1.016 pad 1.88: 1 0,0; 2 2.54,0; 3 5.08,0; 4 7.62,0; 5 10.16,0; 6 12.7,0; 7 15.24,0; 8 17.78,0; 9 20.32,0; 10 22.86,0; 11 25.4,0; 12 27.94,0; 13 30.48,0; 14 33.02,0
1X04 = drill 1.016 pad 1.88 square: 1 0,0 | drill 1.016 pad 1.88: 2 2.54,0; 3 5.08,0; 4 7.62,0
1X04_NO_SILK_ALL_ROUND = drill 1.016 pad 1.88: 1 0,0; 2 2.54,0; 3 5.08,0; 4 7.62,0
PAD-JUMPER-2-NC_BY_TRACE_YES_SILK = smd 0.635 x 1.27: 1 -0.508,0; 2 0.508,0
RELAY_TE_7-1393239-7 = drill 1.3: COIL-1 -12.15,3.67; COIL-2 -12.15,-3.83; MAIN-1 8.15,3.67; MAIN-2 8.15,-3.83; NC-1 3.11,3.67; NC-2 3.11,-3.83; NO-1 13.19,3.67; NO-2 13.19,-3.83
LED3MM = drill 0.813 pad 1.88: A -1.27,0 | drill 0.813 pad 1.88 square: K 1.27,0
TOOLING_HOLE_0.125_IN_HORSESHOE = drill 3.2: P$1 0,0
TO-220-VERTICAL = drill 1.016 long: P1 -2.54,0; P2 0,0; P3 2.54,0
AXIAL-0.4 = drill 0.9 pad 1.88: P$1 -5.08,0; P$2 5.08,0
SK95-2M3 = drill 1.5 pad 3: P$1 0,2.54
DIP787W45P254L3556H508Q28 = drill 0.82 pad 1.23 square: 1 -3.935,16.51 | drill 0.82 pad 1.23: 2 -3.935,13.97; 3 -3.935,11.43; 4 -3.935,8.89; 5 -3.935,6.35; 6 -3.935,3.81; 7 -3.935,1.27; 8 -3.935,-1.27; 9 -3.935,-3.81; 10 -3.935,-6.35; 11 -3.935,-8.89; 12 -3.935,-11.43; 13 -3.935,-13.97; 14 -3.935,-16.51; 15 3.935,-16.51; 16 3.935,-13.97; 17 3.935,-11.43; 18 3.935,-8.89; 19 3.935,-6.35; 20 3.935,-3.81; 21 3.935,-1.27; 22 3.935,1.27; 23 3.935,3.81; 24 3.935,6.35; 25 3.935,8.89; 26 3.935,11.43; 27 3.935,13.97; 28 3.935,16.51
VRG_NID100-X = drill 1 pad 1.778 square: P$1 -24.13,-2 | drill 1 pad 1.778: P$2 -21.59,-2; P$3 -19.05,-2; P$4 -16.51,-2; P$5 -13.97,-2; P$6 -11.43,-2; P$7 8.89,-2; P$8 11.43,-2; P$9 13.97,-2; P$10 16.51,-2; P$11 19.05,-2; P$12 21.59,-2; P$13 24.13,-2

### Placement (x,y rotation side)
ASM-1  13.97,78.74 180 top
ASM-2  77.47,67.31 270 top
ASM-3  46.99,52.07 180 top
ASM-4  15.62,38.23 90 top
C1  73.66,85.09 270 top
C2  36.02,15.95 270 top
D1  64.77,27.94 270 top
J1  30.48,85.09 0 top
J2  36.83,91.44 0 top
J3  53.34,92.71 270 top
J4  58.42,93.98 270 top
J5  26.67,83.82 270 top
J6  93.98,74.93 180 top
J7  64.82,62.23 90 top
J8  93.98,67.31 0 top
J9  93.98,57.15 0 top
J10  91.44,44.45 0 top
J11  93.98,49.53 0 top
J12  34.29,41.91 90 top
J13  59.69,31.75 90 top
J14  66.04,38.1 270 top
J15  2.54,22.86 90 top
J16  27.94,22.86 90 top
J17  38.25,22.2 0 top
J18  50.9,22.2 0 top
J19  66.04,20.32 270 top
J20  15.24,6.35 0 top
J21  31.75,6.35 0 top
J22  82.55,14.63 180 top
J23  91.44,15.24 0 top
JP1  17.88,81.18 0 top
JP2  17.88,78.54 0 top
JP3  30.48,82.55 90 top
JP4  33.02,82.55 90 top
JP5  35.56,82.55 90 top
JP6  38.1,82.55 90 top
JP7  40.64,82.55 90 top
JP8  43.18,82.55 90 top
K1  82.55,36.83 0 top
K2  82.55,22.86 0 top
LED1  64.77,41.91 90 top
LED2  44.45,16.51 180 top
MH1  3.81,95.25 0 top
MH2  95.25,95.25 0 top
MH3  3.81,3.81 0 top
MH4  95.25,3.81 0 top
Q1  64.77,86.36 90 top
Q2  81.28,49.53 270 top
R1  53.34,86.36 180 top
R2  73.66,95.25 0 top
R3  73.66,91.44 180 top
R4  53.34,82.55 0 top
R5  40.64,46.99 90 top
R6  45.72,46.99 270 top
R7  50.8,46.99 90 top
R8  72.39,53.34 0 top
R9  72.39,49.53 180 top
R10  72.39,45.72 180 top
R11  53.9,16.71 180 top
THM-1  86.36,87.63 270 top
U1  15.24,31.75 0 top
VRG-1  82.55,87.63 270 top
VRG-2  66.04,6.89 0 top

### Tracks (layer width: path | path; a pad name or v marks a point on that pad's centre or on a via)
3V
  Top 0.152: J13.2 ASM-3.3V3
5V
  pour Top (isolate 0.305, rank 2): -3.81,100.33 -3.81,-3.81 102.87,-3.81 102.87,100.33
24V
  Top 0.61: J3.1 53.36,93.98 J4.1 66.04,93.98 R3.P$2 73.18,86.84 C1.+ 74.45,87.63 VRG-1.P2
24V-CUTOUT
  cutout Top (isolate 0.305, rank 2): 50.8,100.33 50.8,79.1 101.6,79.1 101.6,100.33
48V
  Top 0.889: J9.1 88.09,60.47 88.09,79.55 87.48,80.16 84.12,80.16 82.55,81.74 VRG-1.P3
  pour Top (isolate 0.813): 100.33,80.16 87.63,80.16 87.63,17.78 72.39,17.78 72.39,-1.27 100.33,-1.27
!AMP-SHDN
  Top 0.152: J12.7 ASM-3.D10 45.72,57.15 R7.P$2 | ASM-1.3 J5.5
  Bottom 0.152: J12.7 30.18,61.27 30.18,70.16 J5.5
ADJ
  Top 0.305: R2.P$2 R3.P$1 80.01,90.17 VRG-1.P1
CRNT-MON
  Top 0.152: ASM-2.5 J7.1 64.62,62.23 63.4,61.01 63.4,45.62 J13.5 ASM-3.A0
DFU
  Top 0.152: ASM-3.DFU J13.16
ENCODER-A
  Top 0.152: J13.14 ASM-3.RX0 55.63,64.77 53.95,66.45 53.95,76.5 52.73,77.72 36.88,77.72 35.56,79.05 JP5.1
ENCODER-B
  Top 0.152: J13.15 ASM-3.TX1 57.05,67.31 54.56,69.8 54.56,76.5 52.73,78.33 42.37,78.33 40.64,80.06 JP7.1
ENCODER-SW
  Top 0.152: J13.10 57.3,54.61 ASM-3.A5 56.34,54.61 53.34,57.61 53.34,76.5 52.73,77.11 34.14,77.11 30.48,80.77 JP3.1
FAN-CTRL  (via drill 0.33)
  Top 0.152: J12.9 ASM-3.D6 38.71,64.11 v38.71,74.68
  Bottom 0.152: v38.71,74.68 46.58,82.55 R4.P$1
GND  (via drill 0.33)
  Top 0.152: JP4.1 33.02,80.97 v33.22,80.77 | JP6.1 v38.1,80.77 | JP8.1 43.28,81.94 v43.28,80.77 | JP1.1 17.27,81.08 v15.85,81.08 | JP2.1 15.95,78.54 v15.85,78.64 | J11.2 J11.1
  pour Bottom (isolate 0.305): -1.27,99.06 -1.27,-1.27 100.33,-1.27 100.33,100.33 -1.27,100.33
I2C-SCL
  Top 0.152: ASM-3.SCL J12.11 31.7,64.72 31.7,23.47 29.57,21.34 18.29,21.34 17.27,20.32 U1.12
I2C-SDA  (via drill 0.33)
  Top 0.152: ASM-3.SDA J12.12 30.79,66.34 v30.79,24.38 | U1.13 12.73,19.2 20.12,19.2 21.03,20.12 29.87,20.12 v30.79,21.03
  Bottom 0.152: v30.79,21.03 v30.79,24.38
K1-NC
  Bottom 0.889: J10.1 86.82,44.45 85.65,43.28 85.65,40.51 K1.NC-1
K2-NC
  Bottom 0.889: J23.1 89.45,15.24 K2.NC-2
LED1-DATA
  Top 0.152: J12.5 ASM-3.D12 R5.P$2
LED2-DATA
  Top 0.152: J12.6 ASM-3.D11 43.18,54.61 R6.P$1
MIST-CTRL
  Top 0.152: J12.10 ASM-3.D5
  Bottom 0.152: ASM-3.D5 42.82,64.77 54.25,53.34 R8.P$1
MIST-VIN
  Bottom 0.889: J7.3 ASM-2.3 83.78,67.31 J6.2 J6.1 93.88,72.25 93.88,47.09 J10.3 96.52,41.28 K1.NO-1 K1.NO-2 97.84,30.9 97.84,16.56 J23.3
N$1
  Top 0.152: J13.1 ASM-3.!RESET
N$2
  Top 0.152: J13.3 ASM-3.AREF
N$5
  Top 0.152: J13.6 ASM-3.A1
N$6
  Top 0.152: J13.7 ASM-3.A2
N$7
  Top 0.152: J13.8 ASM-3.A3
N$8
  Top 0.152: J13.9 ASM-3.A4
N$9
  Top 0.152: J20.3 J20.4 21.95,14.33 24.85,14.33 34.75,24.22 34.75,36.02 R5.P$1
N$10
  Top 0.305: J19.2 69.15,17.78 K2.COIL-2 | D1.A 64.77,34.29 J14.2 67.84,35.56 K1.COIL-2 77.47,40.07 R10.P$1 77.47,46.99 80.01,49.53 Q2.P2
  Bottom 0.305: K2.COIL-2 72.85,21.48 72.85,30.55 K1.COIL-2
N$11
  Top 0.152: R9.P$1 R8.P$2 78.74,52.07 Q2.P1
N$12
  Top 0.61: J3.2 58.4,91.46 J4.2 63.5,86.36 Q1.P2
N$13
  Top 0.152: LED1.K R10.P$2
N$14
  Top 0.152: J5.3 ASM-1.5 22.66,78.54 JP2.2
N$15
  Top 0.152: J5.2 ASM-1.6 22.76,81.18 JP1.2
N$16
  Bottom 0.889: J7.2 ASM-2.4 72.69,64.77 84.73,52.73 84.73,46.33 82.6,44.2 82.6,31.7 84.43,29.87 92.4,29.87 K2.NO-1 K2.NO-2
N$17
  Top 0.152: R1.P$1 R4.P$2 59.69,83.82 Q1.P1
N$18
  Top 0.152: J2.1 30.48,86.36 J1.1 JP3.2
N$19
  Top 0.152: R11.P$2 48.62,16.51 LED2.A
N$20
  Top 0.152: J12.8 ASM-3.D9
N$21
  Top 0.152: J2.2 34.29,92.27 35.41,91.15 35.41,89.05 32.92,86.56 32.92,85.19 J1.2 JP4.2
N$22
  Top 0.152: J2.3 36.83,88.65 35.56,87.38 J1.3 JP5.2
N$24
  Top 0.152: J12.4 ASM-3.D13
N$25
  Top 0.152: J12.2 ASM-3.EN
N$26
  Top 0.152: ASM-4.13 25.36,53.34 J16.13
N$27  (via drill 0.33)
  Top 0.152: J22.1 82.55,12.24 v84.43,10.36
  Bottom 0.152: v84.43,10.36 89.9,4.89 VRG-2.P$13
N$29  (via drill 0.33)
  Top 0.152: J22.2 80.01,12.34 v82.3,10.06
  Bottom 0.152: v82.3,10.06 82.46,10.06 VRG-2.P$12
N$30
  Top 0.152: J15.5 5.02,33.02 ASM-4.24
N$31
  Top 0.152: J15.6 5.02,35.56 ASM-4.23
N$38
  Top 0.152: J15.7 5.02,38.1 ASM-4.22
N$39
  Top 0.152: J2.4 38.1,91.44 J1.4 JP6.2
N$40
  Top 0.152: J2.5 39.37,88.65 40.64,87.38 J1.5 JP7.2
N$41
  Top 0.152: J2.6 43.18,88.9 J1.6 JP8.2
N$42
  Top 0.152: J21.3 J21.4 31.39,7.98 31.39,19.2 35.97,23.77 35.97,33.22 44.65,41.91 R6.P$2
SFX-0
  Top 0.152: J16.2 27.93,25.39 ASM-4.2 24.91,25.39 22.55,27.74 22.55,29.64 U1.22
SFX-1
  Top 0.152: J16.3 25.36,27.94 ASM-4.3 25.11,27.93 23.16,29.87 23.16,31.57 U1.23
SFX-2
  Top 0.152: J16.4 25.6,30.48 25.36,30.48 | 25.36,30.48 ASM-4.4 | U1.24 23.77,33.5 23.77,31.7 24.99,30.48 25.36,30.48
SFX-3
  Top 0.152: J16.5 25.36,33.02 | 25.36,33.02 ASM-4.5 | U1.25 23.77,36.04 23.77,34.44 25.2,33.02 25.36,33.02
SFX-4
  Top 0.152: J16.6 25.36,35.56 ASM-4.6 23.47,37.43 23.47,38.88 U1.26
SFX-5
  Top 0.152: J16.7 25.6,38.1 25.36,38.1 | 25.36,38.1 ASM-4.7 | U1.27 23.47,41.42 23.47,39.93 25.3,38.1 25.36,38.1
SFX-6
  Top 0.152: J16.8 25.36,40.64 | 25.36,40.64 ASM-4.8 | U1.28 23.47,43.97 23.47,42.53 25.36,40.64
SFX-7
  Top 0.152: J16.9 25.36,43.18 ASM-4.9
  Bottom 0.152: U1.8 17.71,36.88 19.2,36.88 25.35,43.03 ASM-4.9
SFX-8
  Top 0.152: J16.10 25.36,45.72 ASM-4.10
  Bottom 0.152: U1.7 17.6,39.32 19.2,39.32 25.35,45.47 ASM-4.10
SFX-9
  Top 0.152: J16.11 25.36,48.26 ASM-4.11
  Bottom 0.152: U1.6 17.5,41.76 19.2,41.76 25.35,47.91 ASM-4.11
SFX-10
  Top 0.152: J16.12 25.36,50.8 ASM-4.12
  Bottom 0.152: U1.5 17.71,44.5 19.2,44.5 25.35,50.65 ASM-4.12
SFX-LOUT
  Top 0.152: J5.4 ASM-1.4 | J15.13 5.02,53.34 ASM-4.16
  Top 0.305: ASM-4.16 19.51,67.8 19.51,73.15 22.55,76.2 ASM-1.4
SFX-ROUT
  Top 0.152: J5.1 ASM-1.7 | J15.12 5.02,50.8 ASM-4.17
  Bottom 0.305: ASM-4.17 17.98,63.74 17.98,80.16 21.64,83.82 ASM-1.7
SFX-RST
  Top 0.152: J16.1 27.93,22.85 25.6,22.85 ASM-4.1 24.4,22.85 21.95,25.3 21.95,27.71 U1.21
SFX-VOL-N
  Top 0.152: J15.9 2.55,43.17 ASM-4.20 11.29,43.17 U1.3
SFX-VOL-P
  Top 0.152: ASM-4.21 4.88,40.63 | 4.88,40.63 2.55,40.63 J15.8 | U1.4 4.89,40.64 4.88,40.63
SPI-MISO
  Top 0.152: ASM-3.MISO J13.13
SPI-MOSI
  Top 0.152: ASM-3.MOSI J13.12
SPI-SCK
  Top 0.152: J13.11 ASM-3.SCK
USB/VBUS
  Top 0.152: J15.3 5.02,27.94 ASM-4.26
VBAT
  Top 0.152: J12.1 ASM-3.VBAT

### Text on the board
tPlace: Rotary Encoder | Fan | HumidiFire | 24V | *MG | v1.0 | A | B | 50V | HUM-ASM-001 | SW | GND | GND | GND | Mist V+ | Mist GND | 48V | DC-In | GND | - | Coil-1 | Coil-2 | Coil-1 | 5V | GND | Coil-2 | - | NC | 48V | NO | LED-1 | LED-2